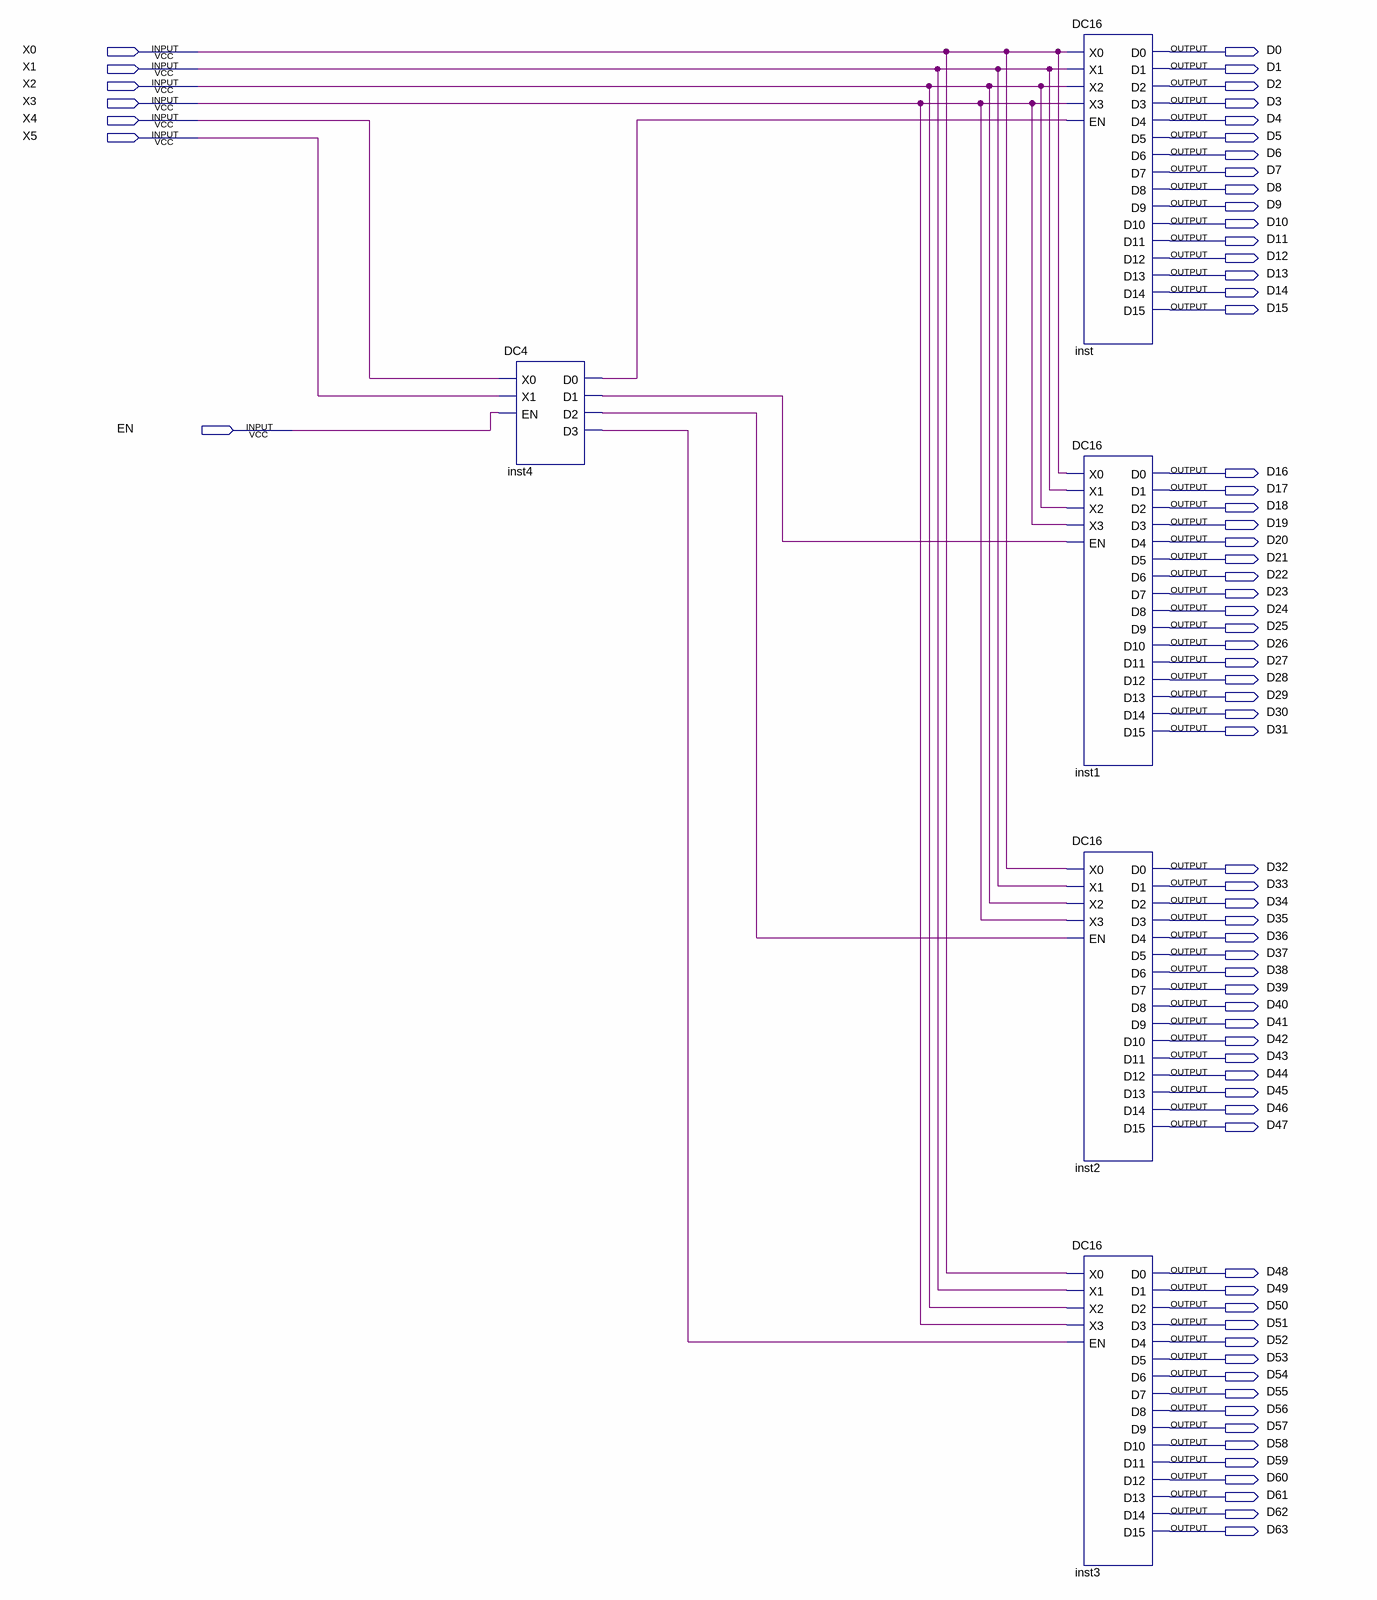
[diagram p0: schematic sheet]
// Quartus schematic DC64.bdf as structural Verilog: 5 symbols, 71 pins
module DC64 (
  input  X0,
  input  X1,
  input  X2,
  input  X3,
  input  X4,
  input  X5,
  input  EN,
  output D0,
  output D1,
  output D2,
  output D3,
  output D4,
  output D5,
  output D6,
  output D7,
  output D8,
  output D9,
  output D10,
  output D11,
  output D12,
  output D13,
  output D14,
  output D15,
  output D16,
  output D17,
  output D18,
  output D19,
  output D20,
  output D21,
  output D22,
  output D23,
  output D24,
  output D25,
  output D26,
  output D27,
  output D28,
  output D29,
  output D30,
  output D31,
  output D32,
  output D33,
  output D34,
  output D35,
  output D36,
  output D37,
  output D38,
  output D39,
  output D40,
  output D41,
  output D42,
  output D43,
  output D44,
  output D45,
  output D46,
  output D47,
  output D48,
  output D49,
  output D50,
  output D51,
  output D52,
  output D53,
  output D54,
  output D55,
  output D56,
  output D57,
  output D58,
  output D59,
  output D60,
  output D61,
  output D62,
  output D63
);

  wire inst4_d0, inst4_d1, inst4_d2, inst4_d3;

  DC4 inst4 (.X0(X4), .X1(X5), .EN(EN), .D0(inst4_d0), .D1(inst4_d1), .D2(inst4_d2), .D3(inst4_d3));
  DC16 inst (
    .X0(X0), .X1(X1), .X2(X2), .X3(X3), .EN(inst4_d0), .D0(D0), .D1(D1), .D2(D2), .D3(D3), .D4(D4), .D5(D5),
    .D6(D6), .D7(D7), .D8(D8), .D9(D9), .D10(D10), .D11(D11), .D12(D12), .D13(D13), .D14(D14), .D15(D15));
  DC16 inst1 (
    .X0(X0), .X1(X1), .X2(X2), .X3(X3), .EN(inst4_d1), .D0(D16), .D1(D17), .D2(D18), .D3(D19), .D4(D20),
    .D5(D21), .D6(D22), .D7(D23), .D8(D24), .D9(D25), .D10(D26), .D11(D27), .D12(D28), .D13(D29), .D14(D30),
    .D15(D31));
  DC16 inst2 (
    .X0(X0), .X1(X1), .X2(X2), .X3(X3), .EN(inst4_d2), .D0(D32), .D1(D33), .D2(D34), .D3(D35), .D4(D36),
    .D5(D37), .D6(D38), .D7(D39), .D8(D40), .D9(D41), .D10(D42), .D11(D43), .D12(D44), .D13(D45), .D14(D46),
    .D15(D47));
  DC16 inst3 (
    .X0(X0), .X1(X1), .X2(X2), .X3(X3), .EN(inst4_d3), .D0(D48), .D1(D49), .D2(D50), .D3(D51), .D4(D52),
    .D5(D53), .D6(D54), .D7(D55), .D8(D56), .D9(D57), .D10(D58), .D11(D59), .D12(D60), .D13(D61), .D14(D62),
    .D15(D63));
endmodule
